# Altium schematic sheet RSX11_SDCard.SchDoc
size A
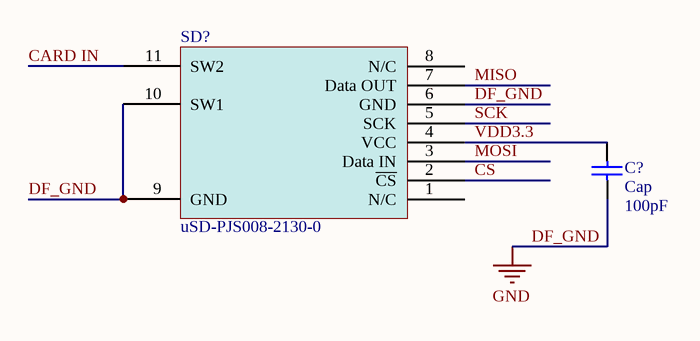
[diagram p0: RSX11_SDCard.SchDoc]

## Parts
C?  Cap  value 100pF  [C1206]
SD?  uSD-PJS008-2130-0  [microSD_push-push]

## Nets
DF_GND: C?.2 SD?.6(GND) SD?.9(GND) SD?.10(SW1)  [also labelled GND]
CARD IN: SD?.11(SW2)
CS: SD?.2(~{CS})
MISO: SD?.7(Data_OUT)
MOSI: SD?.3(Data_IN)
SCK: SD?.5(SCK)
VDD3.3: C?.1 SD?.4(VCC)

Not connected (* = marked no-connect by the designer): SD? 1(N/C) 8(N/C)

## Library data of the parts
C? = Cap: Capacitor; Published: 8-Jun-2000; LatestRevisionDate: 17-Jul-2002; LatestRevisionNote: Re-released for DXP Platform.; PackageReference: RAD-0.3; Publisher: Altium Limited
SD? = microSD_card_push-push: RockOn 2016 SD card midification (part number PJS008-2130-0) -Jesse Austin